# Altium schematic sheet schematicCharger.SchDoc
size 228 x 304 mm
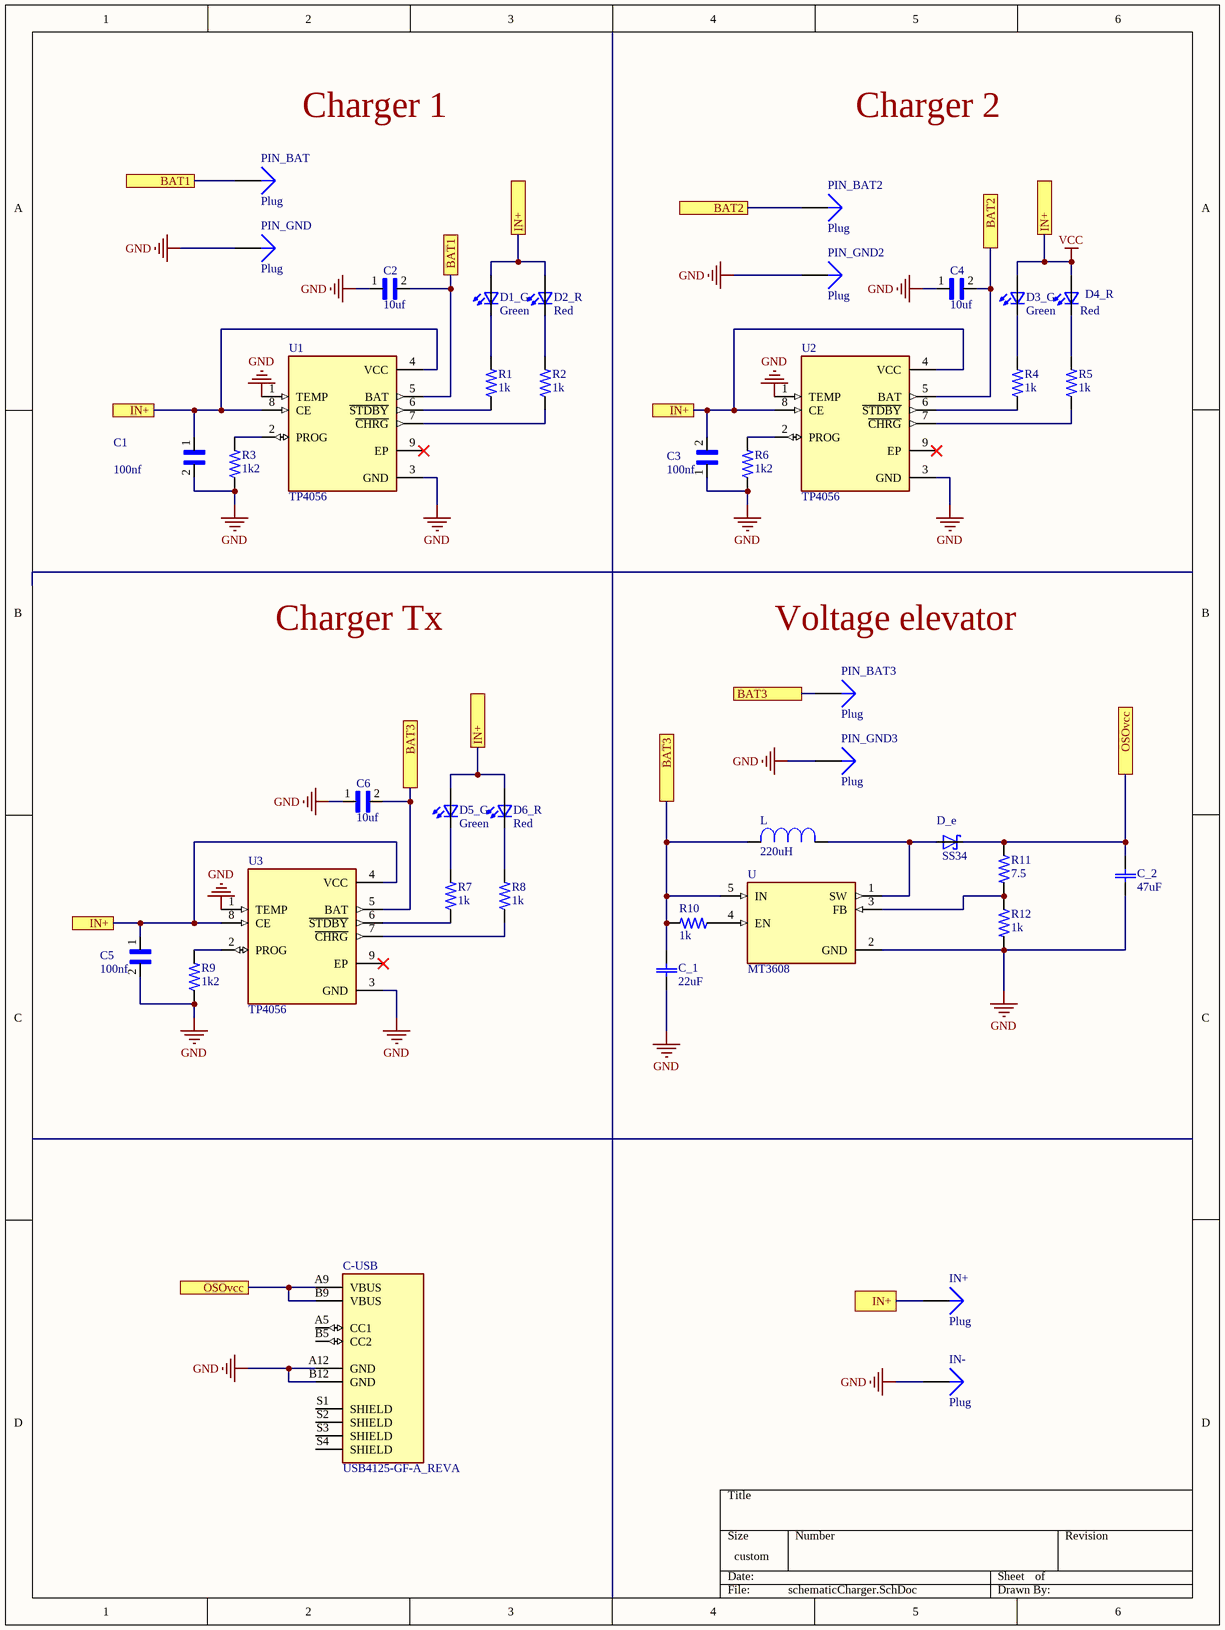
[diagram p0: schematicCharger.SchDoc]

## Parts
C1  100nf  [CAPC1608X90]
C2  10uf  [CAPC1608X90]
C3  100nf  [CAPC1608X90]
C4  10uf  [CAPC1608X90]
C5  100nf  [CAPC1608X90]
C6  10uf  [CAPC1608X90]
C-USB  USB4125-GF-A_REVA  [GCT_USB4125-GF-A_REVA]
C_1  22uF  [CAPC4532X254N]
C_2  47uF  [CAPC4532X254N]
D1_G  Green  [0603gree]
D2_R  Red  [0603red]
D3_G  Green  [0603gree]
D4_R  Red  [0603red]
D5_G  Green  [0603gree]
D6_R  Red  [0603red]
D_e  SS34  [DIOM6859X262N]
IN+  Plug  [PIN1]
IN-  Plug  [PIN1]
L  220uH  [INDM7676X435N]
PIN_BAT  Plug  [PIN1]
PIN_BAT2  Plug  [PIN1]
PIN_BAT3  Plug  [PIN1]
PIN_GND  Plug  [PIN1]
PIN_GND2  Plug  [PIN1]
PIN_GND3  Plug  [PIN1]
R1  1k  [RESC1608X50N]
R2  1k  [RESC1608X50N]
R3  1k2  [RESC1608X50N]
R4  1k  [RESC1608X50N]
R5  1k  [RESC1608X50N]
R6  1k2  [RESC1608X50N]
R7  1k  [RESC1608X50N]
R8  1k  [RESC1608X50N]
R9  1k2  [RESC1608X50N]
R10  1k  [RESC1608X50N]
R11  7.5  [RESC1608X50N]
R12  1k  [RESC1608X50N]
U  MT3608  [SOT95P280X145-6N]
U1  TP4056  [SOP127P600X175-9N]
U2  TP4056  [SOP127P600X175-9N]
U3  TP4056  [SOP127P600X175-9N]

## Ports
BAT1, BAT2, BAT3, IN+, OSOvcc

## Nets
GND: C1.2 C2.1 C3.1 C4.1 C5.2 C6.1 C-USB.A12(GND) C-USB.B12(GND) C_1.1(C1) C_2.1(C1) IN-.1 PIN_GND.1 PIN_GND2.1 PIN_GND3.1 R3.1 R6.1 R9.1 R12.2 U.2(GND) U1.1(TEMP) U1.3(GND) U2.1(TEMP) U2.3(GND) U3.1(TEMP) U3.3(GND)
VCC: C1.1 C3.2 C5.1 D1_G.2(A2) D2_R.2(A2) D3_G.2(A2) D4_R.2(A2) D5_G.2(A2) D6_R.2(A2) IN+.1 U1.4(VCC) U1.8(CE) U2.4(VCC) U2.8(CE) U3.4(VCC) U3.8(CE) ; port IN+
BAT1: C2.2 PIN_BAT.1 U1.5(BAT) ; port BAT1
BAT2: C4.2 PIN_BAT2.1 U2.5(BAT) ; port BAT2
BAT3: C6.2 C_1.2(C2) L.2 PIN_BAT3.1 R10.2 U.5(IN) U3.5(BAT) ; port BAT3
OSOvcc: C-USB.A9(VBUS) C-USB.B9(VBUS) C_2.2(C2) D_e.C R11.1 ; port OSOvcc
NetD1_G_1: D1_G.1(K2) R1.2
NetD2_R_1: D2_R.1(K2) R2.2
NetD3_G_1: D3_G.1(K2) R4.2
NetD4_R_1: D4_R.1(K2) R5.2
NetD5_G_1: D5_G.1(K2) R7.2
NetD6_R_1: D6_R.1(K2) R8.2
NetD_e_A: D_e.A L.1 U.1(SW)
NetR1_1: R1.1 U1.6(~{STDBY})
NetR2_1: R2.1 U1.7(~{CHRG})
NetR3_2: R3.2 U1.2(PROG)
NetR4_1: R4.1 U2.6(~{STDBY})
NetR5_1: R5.1 U2.7(~{CHRG})
NetR6_2: R6.2 U2.2(PROG)
NetR7_1: R7.1 U3.6(~{STDBY})
NetR8_1: R8.1 U3.7(~{CHRG})
NetR9_2: R9.2 U3.2(PROG)
NetR10_1: R10.1 U.4(EN)
NetR11_2: R11.2 R12.1 U.3(FB)

Not connected (* = marked no-connect by the designer): C-USB A5(CC1) B5(CC2) S1(SHIELD) S2(SHIELD) S3(SHIELD) S4(SHIELD); U1 9(EP)*; U2 9(EP)*; U3 9(EP)*

## Notes on the sheet
- Charger 1
- Charger 2
- Charger Tx
- Voltage elevator

## Library data of the parts
C1-C6 = CC0603KRX7R9BB104: 0.1ÂµF Â±10% 50V Ceramic Capacitor X7R 0603 _1608 Metric_; MF: Yageo; Digi-Key_Purchase_URL: https://www.digikey.com/product-detail/en/yageo/CC0603KRX7R9BB104/311-1344-1-ND/2103128?utm_source=snapeda&utm_medium=aggregator&utm_campaign=symbol; Digi-Key_Part_Number: 311-1344-1-ND; Package: 0603 Yageo; MP: CC0603KRX7R9BB104; Value: *; SnapEDA_Link: https://www.snapeda.com/parts/CC0603KRX7R9BB104/Yageo/view-part/78680/?ref=snap
C-USB = USB4125-GF-A_REVA: USB 2.0 Type C Receptacle, Horizontal, SMT, For Power charging; MF: Global Connector Technology; SnapEDA_Link: https://www.snapeda.com/parts/USB4125-GF-A/Global%20Connector%20Technology/view-part/5160675/?ref=snap; Package: None; Check_prices: https://www.snapeda.com/parts/USB4125-GF-A/Global%20Connector%20Technology/view-part/5160675/?ref=eda; MP: USB4125-GF-A; Value: *; Availability: Unavailable; Price: None
C_1 C_2 = 1812PC334KAT1A: 0.33ÂµF Â±10% 250V Ceramic Capacitor X7R 1812 (4532 Metric); MF: AVX; Value: *; Check_prices: https://www.snapeda.com/parts/1812PC334KAT1A/AVX/view-part/607553/?ref=eda; Purchase-URL: https://pricing.snapeda.com/search/part/1812PC334KAT1A/?ref=eda; Price: None; MP: 1812PC334KAT1A; SnapEDA_Link: https://www.snapeda.com/parts/1812PC334KAT1A/AVX/view-part/607553/?ref=snap; Availability: Warning; Package: 1812 AVX
D1_G D2_R D3_G D4_R D5_G D6_R = LTST-C191KGKT: Green 571nm LED Indication - Discrete 2V 0603 _1608 Metric_; MF: Lite-On Inc.; Package: 0603 Lite-On; Price: None; Availability: Unavailable; MP: LTST-C191KGKT; SnapEDA_Link: https://www.snapeda.com/parts/LTST-C191KGKT/Lite-On%20Inc./view-part/48565/?ref=snap; Value: *
D_e = SS34: Diode; Repetitive Reverse Voltage Max, Vrrm: 40V; Forward Current, If(AV): 3A; Forward Surge Current Max, Ifsm: 100A;...; MF: ON Semiconductor; MP: SS34; Package: SMC-2 ON Semiconductor; Availability: Good; Price: None; Purchase-URL: https://pricing.snapeda.com/search/part/SS34/?ref=eda; Check_prices: https://www.snapeda.com/parts/SS34/ON%20Semiconductor/view-part/547583/?ref=eda; SnapEDA_Link: https://www.snapeda.com/parts/SS34/ON%20Semiconductor/view-part/547583/?ref=snap; Value: *
L = DR74-2R2-R: 2.2ÂµH Shielded Wirewound Inductor 4.76A 12.6mOhm Nonstandard; MF: Eaton; Package: Nonstandard Eaton; MP: DR74-2R2-R; Price: None; Availability: Unavailable; Value: *; SnapEDA_Link: https://www.snapeda.com/parts/DR74-2R2-R/Eaton/view-part/2774133/?ref=snap
R1-R12 = RP73D1J13RBTDG: Res, Thin Film, 13r, 0.1%, 0.1w, 0603; MF: TE Connectivity; MP: RP73D1J13RBTDG; Availability: Unavailable; SnapEDA_Link: https://www.snapeda.com/parts/RP73D1J13RBTDG/TE%20Connectivity/view-part/970906/?ref=snap; Package: 0603 TE Connectivity / AMP; Price: None; TE_purchase_URL: https://www.te.com/usa-en/product-RP73D1J13RBTDG.html?te_bu=Cor&te_type=disp&te_campaign=seda_glo_cor-seda-global-disp-prtnr-fy19-seda-model-bom-cta_sma-317_1&elqCampaignId=32493; Value: *
U = MT3608: High Efficiency 1.2MHz2A Step Up Converter; MF: Aerosemi Technology Co., Ltd; Package: Package Analog Devices; Availability: Unavailable; Value: *; MP: MT3608; SnapEDA_Link: https://www.snapeda.com/parts/MT3608/Aerosemi%20Technology%20Co.%2C%20Ltd/view-part/3218014/?ref=snap; Price: None
U1-U3 = TP4056: Complete single cell Li-Ion battery with a constant current / constant voltage linear charger; MF: NanJing Top Power ASIC Corp.; Price: None; Availability: No availability data; Value: *; MP: TP4056; Check_prices: https://www.snapeda.com/parts/TP4056%20/NanJing%20Top%20Power%20ASIC%20Corp./view-part/2888426/?ref=eda; SnapEDA_Link: https://www.snapeda.com/parts/TP4056%20/NanJing%20Top%20Power%20ASIC%20Corp./view-part/2888426/?ref=snap; Package: Package
IN+ IN- PIN_BAT PIN_BAT2 PIN_BAT3 PIN_GND PIN_GND2 PIN_GND3 = Plug: LatestRevisionDate: 17-Jul-2002; LatestRevisionNote: Re-released for DXP Platform.; Publisher: Altium Limited